# Altium schematic sheet E-paper.SchDoc: MesureTH
size 276 x 198 mm; Date: 21.08.2024; CheckedBy: CFO; DrawnBy: MPT; Organization: ETML-ES; Address1: Av. Recordon 1bis; Address2: 1004 Lausanne; Address3: Suisse; DocumentNumber: 2409; SheetNumber: 5; SheetTotal: 5; CheckingDate: 26.08.2024
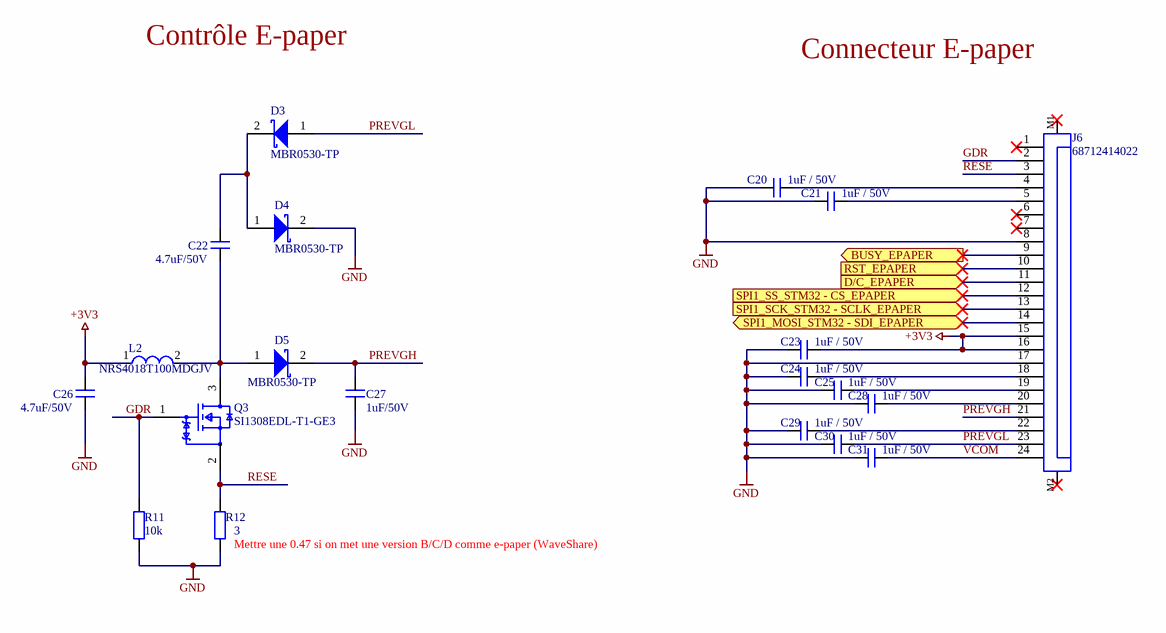
[diagram p0: E-paper.SchDoc]

## Parts
C20  1uF / 50V  [WCAP-CSGP_0805_L2W1.25H0.8_Wave]
C21  1uF / 50V  [WCAP-CSGP_0805_L2W1.25H0.8_Wave]
C22  4.7uF/50V  [WCAP-CSGP_0805_L2W1.25H0.8_Wave]
C23  1uF / 50V  [WCAP-CSGP_0805_L2W1.25H0.8_Wave]
C24  1uF / 50V  [WCAP-CSGP_0805_L2W1.25H0.8_Wave]
C25  1uF / 50V  [WCAP-CSGP_0805_L2W1.25H0.8_Wave]
C26  4.7uF/50V  [WCAP-CSGP_0805_L2W1.25H0.8_Wave]
C27  1uF/50V  [WCAP-CSGP_0805_L2W1.25H0.8_Wave]
C28  1uF / 50V  [WCAP-CSGP_0805_L2W1.25H0.8_Wave]
C29  1uF / 50V  [WCAP-CSGP_0805_L2W1.25H0.8_Wave]
C30  1uF / 50V  [WCAP-CSGP_0805_L2W1.25H0.8_Wave]
C31  1uF / 50V  [WCAP-CSGP_0805_L2W1.25H0.8_Wave]
D3  MBR0530-TP  [ONSC-SOD-123-2-425-04_V]
D4  MBR0530-TP  [ONSC-SOD-123-2-425-04_V]
D5  MBR0530-TP  [ONSC-SOD-123-2-425-04_V]
J6  68712414022  [68712414022]
L2  NRS4018T100MDGJV  [FP-NR4018-MFG]
Q3  SI1308EDL-T1-GE3  [FP-5549-MFG]
R11  10k  [WRIS-PSMB_0805_L2W1.25H0.35]
R12  3  [WRIS-PSMB_0805_L2W1.25H0.35]

## Ports
BUSY_EPAPER (out), D/C_EPAPER (in), RST_EPAPER (in), SPI1_MOSI_STM32 - SDI_EPAPER (bidir), SPI1_SCK_STM32 - SCLK_EPAPER (in), SPI1_SS_STM32 - CS_EPAPER (in)

## Nets
+3V3: C23.2(-) C26.1(+) J6.15 J6.16 L2.1
GND: C20.1(+) C21.1(+) C23.1(+) C24.1(+) C25.1(+) C26.2(-) C27.2(-) C28.1(+) C29.1(+) C30.1(+) C31.1(+) D4.2(C) J6.8 J6.17 R11.1 R12.1
BUSY_EPAPER: J6.9 ; port BUSY_EPAPER
D/C_EPAPER: J6.11 ; port D/C_EPAPER
GDR: J6.2 Q3.1(G) R11.2
PREVGH: C27.1(+) D5.2(C) J6.21
PREVGL: C30.2(-) D3.1(A) J6.23
RESE: J6.3 Q3.2(S) R12.2
RST_EPAPER: J6.10 ; port RST_EPAPER
SPI1_MOSI_STM32 - SDI_EPAPER: J6.14 ; port SPI1_MOSI_STM32 - SDI_EPAPER
SPI1_SCK_STM32 - SCLK_EPAPER: J6.13 ; port SPI1_SCK_STM32 - SCLK_EPAPER
SPI1_SS_STM32 - CS_EPAPER: J6.12 ; port SPI1_SS_STM32 - CS_EPAPER
VCOM: C31.2(-) J6.24
NetC20_2: C20.2(-) J6.4
NetC21_2: C21.2(-) J6.5
NetC22_1: C22.1(+) D3.2(C) D4.1(A)
NetC22_2: C22.2(-) D5.1(A) L2.2 Q3.3(D)
NetC24_2: C24.2(-) J6.18
NetC25_2: C25.2(-) J6.19
NetC28_2: C28.2(-) J6.20
NetC29_2: C29.2(-) J6.22

Not connected (* = marked no-connect by the designer): J6 1* 6* 7* M1* M2*

## Notes on the sheet
- Contrôle E-paper
- Connecteur E-paper
- (near R12) Mettre une 0.47 si on met une version B/C/D comme e-paper (WaveShare)
- a
- Dessiné
- A4
- Echelle :
- Mod.
- b
- c
- d
- Contrôlé
- Remplace
- Nb. feuilles
- Feuille n°
- Nom du projet
- No

## Library data of the parts
C20-C31 = CAPA: Tension: *
J6 = CMP-1502-01558-2: NexarPartId: 22802323; Pitch: 500µm; Current Rating: 500mA; Number of Positions: 24; Contact Resistance: 20mΩ; Actuator Material: Liquid Crystal Polymer, Polymer; Insulation Resistance: 100MΩ; Contact Location: Top; Gender: Receptacle; Operating Supply Voltage: 50V; Mount: Surface Mount; Max Operating Temperature: 85°C; Number of Rows: 1; Housing Material: Liquid Crystal Polymer; Contact Material: Bronze, Tin; Termination: Solder; Flammability Rating: UL94 V-0; Number of Contacts: 24; Packaging: Tape and Reel; RoHS: Compliant; Min Operating Temperature: -25°C; Orientation: Horizontal; Contact Plating: Tin; Lead Pitch: 500µm; Width: 2.1mm; Length: 12.6mm; REACH SVHC: Unknown; Voltage Rating: 50V; Number of Pins: 24
L2 = CMP-14484-000008-2: SMD Power Inductors for Automotive Applications 10uH ±20% 1.2A 0.18Ω; Core Material: Ferrite; Shielding: Shielded; Test Frequency: 100kHz; Saturation Current: 1.3A; Self Resonant Frequency: 25MHz; DC Resistance (DCR): 180mR; Inductance: 10uH; RoHS Compliant: Yes; Resistor Type: Wirewound; Depth: 4mm; Mount: Surface Mount; Termination: SMD/SMT; Packaging: Tape and Reel; Length: 4mm; Max DC Current: 1.2A; Max Operating Temperature: 125°C; Min Operating Temperature: -40°C; Halogen Free: Halogen Free; Width: 0.157inch; Package Quantity: 3500; Height - Seated (Max): 0.071inch; Weight: 0.003527oz; Tolerance: 20%; Ratings: AEC-Q200; Radiation Hardening: No; Current Rating: 1.2A; Case/Package: Nonstandard; Height: 1.8mm
Q3 = CMP-02550-000099-2: MOSFET N-CH 30V 1.4A SC-70-3; Fall Time: 8ns; Max Power Dissipation: 500mW; Rise Time: 9ns; Rds On Max: 132mR; Power Dissipation: 400mW; Polarity: N-CHANNEL; Number of Elements: 1; Element Configuration: Single; Threshold Voltage: 600mV; Continuous Drain Current (ID): 1.5A; Gate to Source Voltage (Vgs): 12V; Turn-On Delay Time: 2ns; Input Capacitance: 105pF; Package Quantity: 3000; REACH SVHC: No SVHC; Mount: Surface Mount; Packaging: Tape and Reel; On-State Resistance: 132mR; Drain-source On Resistance-Max: 132mR; Lead Free: Lead Free; Drain to Source Breakdown Voltage: 30V; Series: TrenchFET®; Max Operating Temperature: 150°C; Drain to Source Resistance: 132mR; Radiation Hardening: No; Length: 2.2mm; Min Operating Temperature: -55°C; Number of Channels: 1; Drain to Source Voltage (Vdss): 30V; Number of Pins: 3; Turn-Off Delay Time: 8ns; Weight: 0.004395oz; RoHS Compliant: Yes; Width: 1.35mm; Height: 1mm; Case/Package: SOT-323
R11 R12 = Res2: Resistor; Fournisseur: ETML-ES; Ref Fournisseur: En stock; Published: 8-Jun-2000; LatestRevisionDate: 17-Jul-2002; LatestRevisionNote: Re-released for DXP Platform.; PackageReference: AXIAL-0.4; Publisher: Altium Limited; PackageDescription: Axial Device, Thru-Hole; 2 Leads; 0.4 in Pin Spacing; Prix unitaire: *